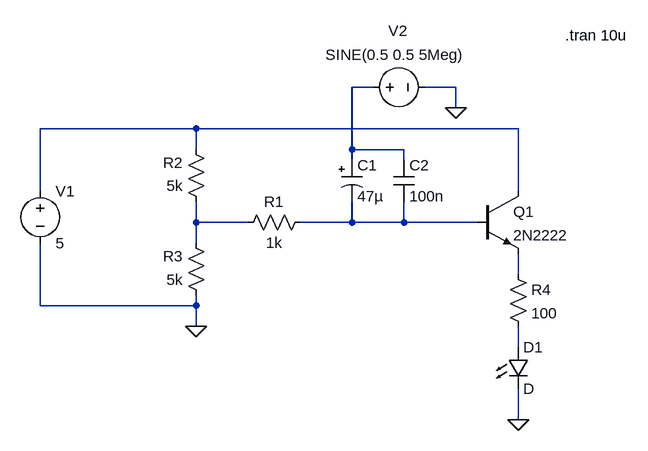
[diagram p0: schematic transmitter.asc]
transmitter.asc, the LTspice schematic file:
Version 4.1
SHEET 1 880 680
WIRE 384 -160 352 -160
WIRE 512 -160 464 -160
WIRE 512 -128 512 -160
WIRE 112 -96 -128 -96
WIRE 608 -96 112 -96
WIRE 112 -64 112 -96
WIRE 352 -64 352 -160
WIRE 432 -64 352 -64
WIRE 352 -48 352 -64
WIRE 432 -48 432 -64
WIRE -128 0 -128 -96
WIRE 608 0 608 -96
WIRE 112 48 112 16
WIRE 192 48 112 48
WIRE 352 48 352 16
WIRE 352 48 272 48
WIRE 432 48 432 16
WIRE 432 48 352 48
WIRE 544 48 432 48
WIRE 112 80 112 48
WIRE 608 128 608 96
WIRE -128 176 -128 80
WIRE 112 176 112 160
WIRE 112 176 -128 176
WIRE 112 208 112 176
WIRE 608 240 608 208
WIRE 608 352 608 304
FLAG 608 352 0
FLAG 112 208 0
FLAG 512 -128 0
SYMBOL voltage -128 -16 R0
WINDOW 123 0 0 Left 0
WINDOW 39 0 0 Left 0
SYMATTR InstName V1
SYMATTR Value 5
SYMBOL voltage 368 -160 R270
WINDOW 0 102 55 VBottom 2
WINDOW 3 65 50 VBottom 2
WINDOW 123 0 0 Left 0
WINDOW 39 0 0 Left 0
SYMATTR InstName V2
SYMATTR Value SINE(0.5 0.5 5Meg)
SYMBOL res 288 32 R90
WINDOW 0 0 56 VBottom 2
WINDOW 3 32 56 VTop 2
SYMATTR InstName R1
SYMATTR Value 1k
SYMBOL res 128 32 R180
WINDOW 0 36 76 Left 2
WINDOW 3 36 40 Left 2
SYMATTR InstName R2
SYMATTR Value 5k
SYMBOL res 128 176 R180
WINDOW 0 36 76 Left 2
WINDOW 3 36 40 Left 2
SYMATTR InstName R3
SYMATTR Value 5k
SYMBOL polcap 336 -48 R0
SYMATTR InstName C1
SYMATTR Value 47µ
SYMBOL cap 416 -48 R0
SYMATTR InstName C2
SYMATTR Value 100n
SYMBOL npn 544 0 R0
SYMATTR InstName Q1
SYMATTR Value 2N2222
SYMBOL LED 592 240 R0
SYMATTR InstName D1
SYMBOL res 592 112 R0
SYMATTR InstName R4
SYMATTR Value 100
TEXT 680 -240 Left 2 !.tran 10u

The netlist it stands for:
* transmitter.asc
V1 N002 0 5
V2 N001 0 SINE(0.5 0.5 5Meg)
R1 N004 N003 1k
R2 N003 N002 5k
R3 0 N003 5k
C1 N001 N004 47µ
C2 N001 N004 100n
Q1 N002 N004 N005 0 2N2222
D1 N006 0 D
R4 N005 N006 100
.model D D
.lib standard.dio
.model NPN NPN
.model PNP PNP
.lib standard.bjt
.tran 10u
.backanno
.end